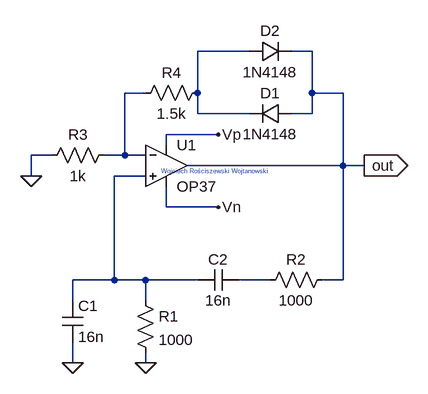
[diagram p0: schematic Wien.asc]
Wien.asc, the LTspice schematic file:
Version 4
SHEET 1 880 680
WIRE 432 -176 352 -176
WIRE 528 -176 496 -176
WIRE 272 -112 240 -112
WIRE 352 -112 352 -176
WIRE 528 -112 528 -176
WIRE 576 -112 528 -112
WIRE 352 -80 352 -112
WIRE 432 -80 352 -80
WIRE 528 -80 528 -112
WIRE 528 -80 496 -80
WIRE 384 -48 304 -48
WIRE 304 -32 304 -48
WIRE 128 -16 96 -16
WIRE 240 -16 240 -112
WIRE 240 -16 208 -16
WIRE 272 -16 240 -16
WIRE 576 0 576 -112
WIRE 576 0 336 0
WIRE 608 0 576 0
WIRE 96 16 96 -16
WIRE 272 16 224 16
WIRE 304 64 304 32
WIRE 384 64 304 64
WIRE 224 176 224 16
WIRE 224 176 160 176
WIRE 272 176 224 176
WIRE 352 176 272 176
WIRE 464 176 416 176
WIRE 576 176 576 0
WIRE 576 176 544 176
WIRE 160 208 160 176
WIRE 272 208 272 176
WIRE 160 304 160 272
WIRE 272 304 272 288
FLAG 272 304 0
FLAG 160 304 0
FLAG 96 16 0
FLAG 608 0 out
IOPIN 608 0 Out
FLAG 384 -48 Vp
FLAG 384 64 Vn
SYMBOL cap 144 208 R0
SYMATTR InstName C1
SYMATTR Value 16n
SYMBOL res 256 192 R0
SYMATTR InstName R1
SYMATTR Value 1000
SYMBOL cap 416 160 R90
WINDOW 0 0 32 VBottom 2
WINDOW 3 32 32 VTop 2
SYMATTR InstName C2
SYMATTR Value 16n
SYMBOL res 560 160 R90
WINDOW 0 0 56 VBottom 2
WINDOW 3 32 56 VTop 2
SYMATTR InstName R2
SYMATTR Value 1000
SYMBOL Opamps\\OP37 304 -64 R0
SYMATTR InstName U1
SYMBOL res 224 -32 R90
WINDOW 0 0 56 VBottom 2
WINDOW 3 32 56 VTop 2
SYMATTR InstName R3
SYMATTR Value 1k
SYMBOL res 368 -128 R90
WINDOW 0 0 56 VBottom 2
WINDOW 3 32 56 VTop 2
SYMATTR InstName R4
SYMATTR Value 1.5k
SYMBOL diode 496 -96 R90
WINDOW 0 0 32 VBottom 2
WINDOW 3 32 32 VTop 2
SYMATTR InstName D1
SYMATTR Value 1N4148
SYMBOL diode 432 -160 R270
WINDOW 0 32 32 VTop 2
WINDOW 3 0 32 VBottom 2
SYMATTR InstName D2
SYMATTR Value 1N4148
TEXT 296 8 Left 0 ;Wojciech Rościszewski Wojtanowski

The netlist it stands for:
* Wien.asc
C1 N003 0 16n
R1 N003 0 1000
C2 N004 N003 16n
R2 out N004 1000
XU1 N003 N002 Vp Vn out LT1037  ; OP37, pins In+ In- V+ V- OUT
R3 N002 0 1k
R4 N001 N002 1.5k
D1 out N001 1N4148
D2 N001 out 1N4148
.model D D
.lib standard.dio
* Wojciech Rościszewski Wojtanowski
.lib LTC.lib
.backanno
.end